# Altium project PCB_Project1.PrjPCB
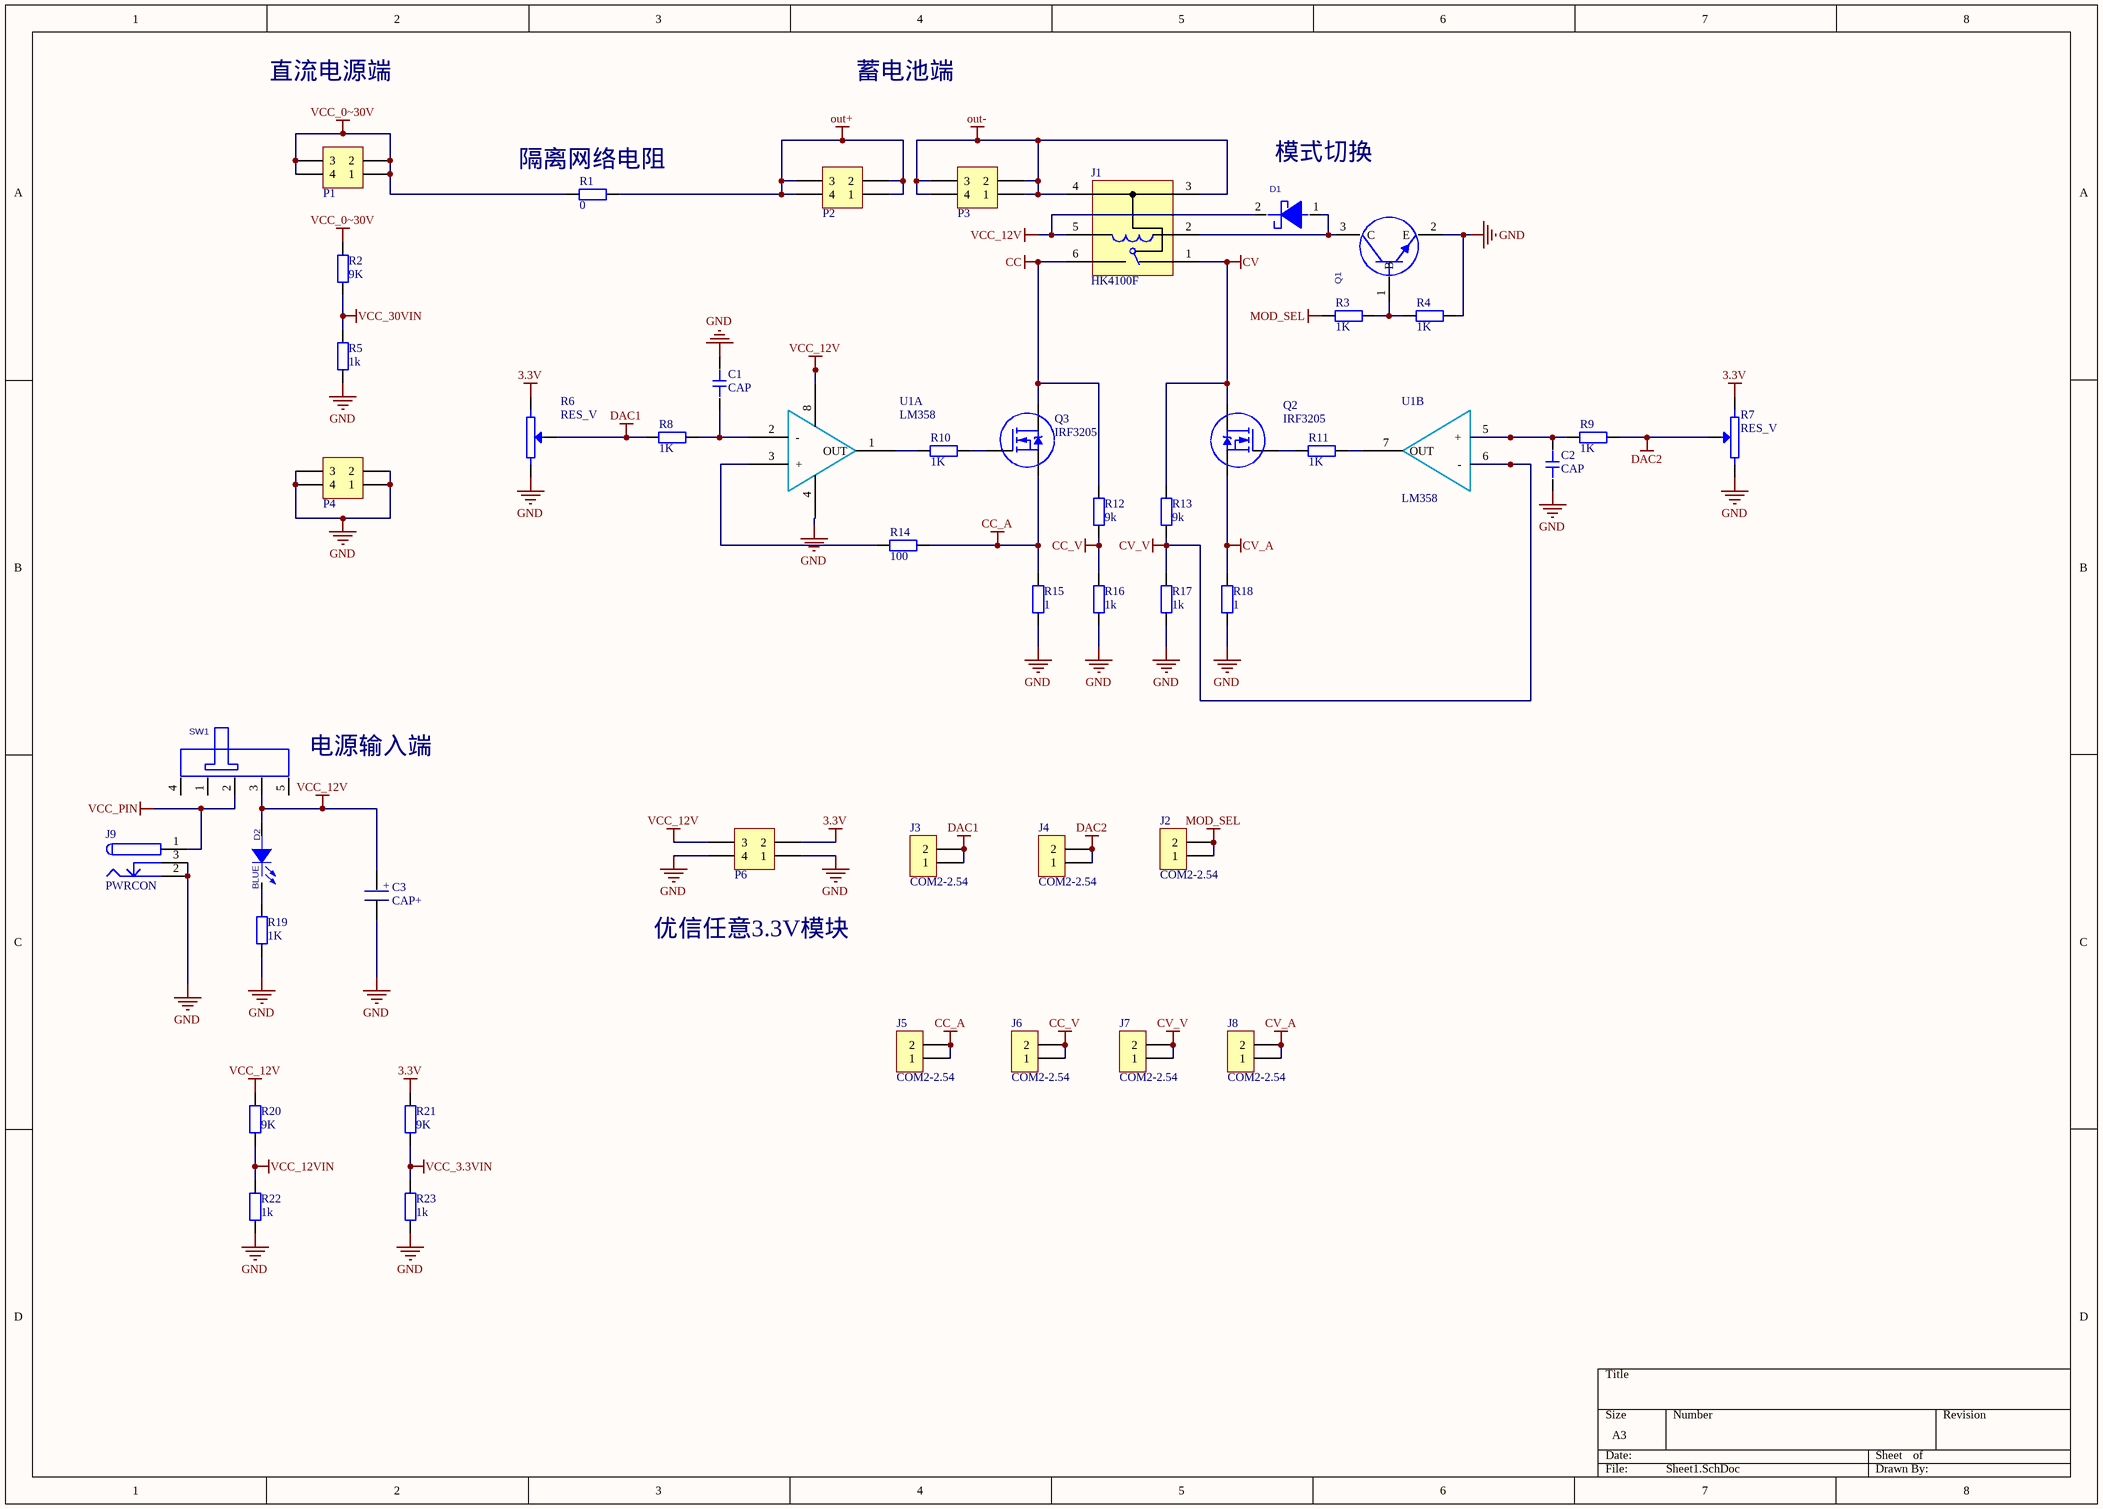
[diagram p0: Sheet1.SchDoc]
2 sheets, 97 parts. Net scope: global (net labels, ports and power ports of the same name join across sheets).
Board file: PCB1.PcbDoc
Sheets:
  Sheet1.SchDoc
  Sheet2.SchDoc

## Sheet Sheet1.SchDoc
size A3

### Parts
C1  CAP  [C_0805]
C2  CAP  [C_0805]
C3  CAP+  [CAP_2]
D1  SMAJ5.0CA  [DO-214-A]  (value not drawn)
D2  value BLUE  [LED_0603]  (hidden comment: LED)
J1  HK4100F  [RELAY-HK4100F]
J2  COM2-2.54  [HDR2X1-2.54]
J3  COM2-2.54  [HDR2X1-2.54]
J4  COM2-2.54  [HDR2X1-2.54]
J5  COM2-2.54  [HDR2X1-2.54]
J6  COM2-2.54  [HDR2X1-2.54]
J7  COM2-2.54  [HDR2X1-2.54]
J8  COM2-2.54  [HDR2X1-2.54]
J9  PWRCON  [DC-005]
P1  Header 2X2A  [HDR2X2-2.54]  (value not drawn)
P2  Header 2X2A  [HDR2X2-2.54]  (value not drawn)
P3  Header 2X2A  [HDR2X2-2.54]  (value not drawn)
P4  Header 2X2A  [HDR2X2-2.54]  (value not drawn)
P6  Header 2X2A  [HDR2X2-2.54]  (value not drawn)
Q1  8050  [SOT-23]  (value not drawn)
Q2  IRF3205  [TO-220L]
Q3  IRF3205  [TO-220L]
R1  value 0  [1210]  (hidden comment: Res1)
R2  value 9K  [0603-1]  (hidden comment: Res1)
R3  value 1K  [0603-1]  (hidden comment: Res1)
R4  value 1K  [0603-1]  (hidden comment: Res1)
R5  value 1k  [0603-1]  (hidden comment: Res1)
R6  RES_V  [RES_V4]
R7  RES_V  [RES_V4]
R8  value 1K  [0603-1]  (hidden comment: Res1)
R9  value 1K  [0603-1]  (hidden comment: Res1)
R10  value 1K  [0603-1]  (hidden comment: Res1)
R11  value 1K  [0603-1]  (hidden comment: Res1)
R12  value 9k  [0603-1]  (hidden comment: Res1)
R13  value 9k  [0603-1]  (hidden comment: Res1)
R14  value 100  [1210]  (hidden comment: Res1)
R15  value 1  [1210]  (hidden comment: Res1)
R16  value 1k  [0603-1]  (hidden comment: Res1)
R17  value 1k  [0603-1]  (hidden comment: Res1)
R18  value 1  [1210]  (hidden comment: Res1)
R19  value 1K  [0603-1]  (hidden comment: Res1)
R20  value 9K  [0603-1]  (hidden comment: Res1)
R21  value 9K  [0603-1]  (hidden comment: Res1)
R22  value 1k  [0603-1]  (hidden comment: Res1)
R23  value 1k  [0603-1]  (hidden comment: Res1)
SW1  SW-POWER  [SW13_6]  (value not drawn)
U1  LM358  [SOP8]  (parts A,B of 2)

### Nets
3.3V: P6.2 R6.4 R7.4 R21.2
CC: J1.6 Q3.2(D) R12.2
CC_A: J5.1 J5.2 Q3.3(S) R14.1 R15.2  [project net ADC0]
CC_V: J6.1 J6.2 R12.1 R16.2  [project net ADC1]
CV: J1.1 Q2.2(D) R13.2
CV_A: J8.1 J8.2 Q2.3(S) R18.2  [project net ADC3]
CV_V: J7.1 J7.2 R13.1 R17.2 U1.6(-)  [project net ADC2]
DAC1: J3.1 J3.2 R6.5(W) R8.1
DAC2: J4.1 J4.2 R7.5(W) R9.2
GND: C1.2 C2.2 C3.2 J9.2 J9.3 P4.1 P4.2 P4.3 P4.4 P6.1 P6.4 Q1.2(E) R4.1 R5.1 R6.6 R7.6 R15.1 R16.1 R17.1 R18.1 R19.1 R22.1 R23.1 U1.4(-VCC)
MOD_SEL: J2.1 J2.2 R3.1
out+: P2.1 P2.2 P2.3 P2.4 R1.1
out-: J1.3 J1.4 P3.1 P3.2 P3.3 P3.4
VCC_0~30V: P1.1 P1.2 P1.3 P1.4 R1.2 R2.2
VCC_3.3VIN: R21.1 R23.2
VCC_12V: C3.1 D1.2(-) D2.1(ANODE) J1.5 P6.3 R20.2 SW1.3 U1.8(VCC)
VCC_12VIN: R20.1 R22.2
VCC_30VIN: R2.1 R5.2
VCC_PIN: J9.1 SW1.2
NetC1_1: C1.1 R8.2 U1.2(-)
NetC2_1: C2.1 R9.1 U1.5(+)
NetD1_1: D1.1(+) J1.2 Q1.3(C)
NetD2_2: D2.2(CATHODE) R19.2
NetQ1_1: Q1.1(B) R3.2 R4.2
NetQ2_1: Q2.1(G) R11.1
NetQ3_1: Q3.1(G) R10.2
NetR10_1: R10.1 U1.1(OUT)
NetR11_2: R11.2 U1.7(OUT)
NetR14_2: R14.2 U1.3(+)

Not connected (* = marked no-connect by the designer): SW1 1 4 5

### Notes on the sheet
- 直流电源端
- 蓄电池端
- (near R1) 隔离网络电阻
- (near D1) 模式切换
- (near SW1) 电源输入端
- 优信任意3.3V模块
- (in symbol CAP+) +

### Library data of the parts
D1 = SMAJ5.0CA: SMAJ5.0CA-E3/61 400W 5V; PCB DECAL: DO-214; Manufacture 1 P/N: SMAJ5.0CA; Value: SMAJ5.0CA
J1 = HK4100F: 单刀双掷继电器
J9 = PWRCON: 直流电源端子; Published: 17-Dec-2003; DatasheetDocument: 09-May-2002; Publisher: Altium Limited; ComponentLink1Description: Manufacturer Link; ComponentLink1URL: http://domino.kycon.com/internet/Products.html
P1-P4 P6 = Header 2X2A: 接插件; LatestRevisionDate: 17-Jul-2002; LatestRevisionNote: Re-released for DXP Platform.; Publisher: Altium Limited
Q1 = 8050: NPN; Manufacturer #2: 8050; PCB DECAL: SOT-23
R1-R5 R8-R23 = Res1: 贴片电阻; Published: 8-Jun-2000; LatestRevisionDate: 17-Jul-2002; LatestRevisionNote: Re-released for DXP Platform.; PackageReference: AXIAL-0.4; Publisher: Altium Limited
SW1 = SW-POWER: SW-5; Manufacturer #1 PN: SW-5; PCB DECAL: SW13_6
D2 = LED: PCB DECAL: LED_0603

## Sheet Sheet2.SchDoc
size A2
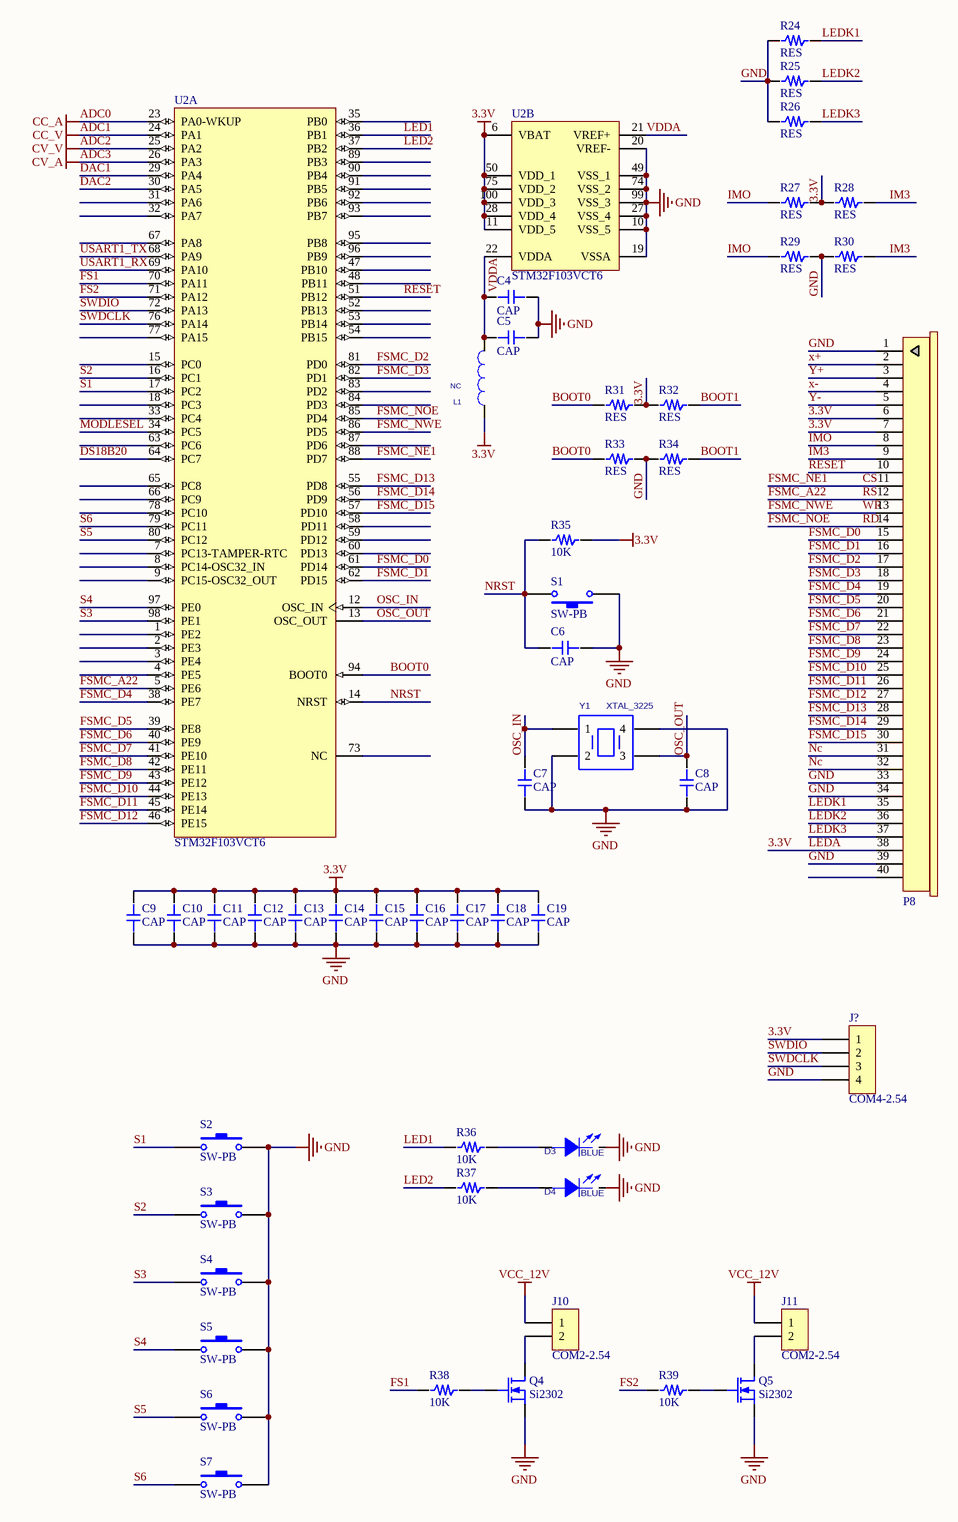
[diagram p1: Sheet2.SchDoc]

### Parts
C4  CAP  [C_0603]
C5  CAP  [C_0603]
C6  CAP  [C_0603-k]
C7  CAP  [C_0603-k]
C8  CAP  [C_0603-k]
C9  CAP  [C_0603]
C10  CAP  [C_0603]
C11  CAP  [C_0603]
C12  CAP  [C_0603]
C13  CAP  [C_0603]
C14  CAP  [C_0603]
C15  CAP  [C_0603]
C16  CAP  [C_0603]
C17  CAP  [C_0603]
C18  CAP  [C_0603]
C19  CAP  [C_0603]
D3  value BLUE  [LED_0603]  (hidden comment: LED)
D4  value BLUE  [LED_0603]  (hidden comment: LED)
J10  COM2-2.54  [COM2-2.54]
J11  COM2-2.54  [COM2-2.54]
J?  COM4-2.54  [COM4-2.54]
L1  value NC  [R_0805]  (hidden comment: IND)
P8  FPC  [FPC0.5-40P-A]  (value not drawn)
Q4  Si2302  [SOT-23]
Q5  Si2302  [SOT-23]
R24  RES  [R_0805]
R25  RES  [R_0805]
R26  RES  [R_0805]
R27  RES  [R_0603]
R28  RES  [R_0603]
R29  RES  [R_0603]
R30  RES  [R_0603]
R31  RES  [R_0603]
R32  RES  [R_0603]
R33  RES  [R_0603]
R34  RES  [R_0603]
R35  10K  [R_0603-k]
R36  10K  [R_0603-k]
R37  10K  [R_0603-k]
R38  10K  [R_0603-k]
R39  10K  [R_0603-k]
S1  SW-PB  [Switch-PB-C-K]
S2  SW-PB  [Switch-PB-C-K]
S3  SW-PB  [Switch-PB-C-K]
S4  SW-PB  [Switch-PB-C-K]
S5  SW-PB  [Switch-PB-C-K]
S6  SW-PB  [Switch-PB-C-K]
S7  SW-PB  [Switch-PB-C-K]
U2  STM32F103VCT6  [STM-LQFP100_N]  (parts A,B of 2)
Y1  XTAL_3225  [XTAL-3225-m]

### Nets
3.3V: C9.2 C10.2 C11.1 C12.1 C13.2 C14.1 C15.1 C16.2 C17.2 C18.2 C19.2 J?.1 L1.1 P8.6 P8.7 P8.38 R27.2 R28.1 R31.2 R32.1 R35.2 U2.6(VBAT) U2.11(VDD_5) U2.28(VDD_4) U2.50(VDD_1) U2.75(VDD_2) U2.100(VDD_3)  [also labelled LEDA]
ADC0: U2.23(PA0-WKUP)  [also labelled CC_A]
ADC1: U2.24(PA1)  [also labelled CC_V]
ADC2: U2.25(PA2)  [also labelled CV_V]
ADC3: U2.26(PA3)  [also labelled CV_A]
DAC1: U2.29(PA4)
DAC2: U2.30(PA5)
GND: C4.2 C5.1 C6.2 C7.1 C8.1 C9.1 C10.1 C11.2 C12.2 C13.1 C14.2 C15.2 C16.1 C17.1 C18.1 C19.1 D3.2(CATHODE) D4.2(CATHODE) J?.4 P8.1 P8.33 P8.34 P8.39 Q4.2(S) Q5.2(S) R24.1 R25.1 R26.1 R29.2 R30.1 R33.2 R34.1 S1.1 S2.2 S3.2 S4.2 S5.2 S6.2 S7.2 U2.10(VSS_5) U2.19(VSSA) U2.20(VREF-) U2.27(VSS_4) U2.49(VSS_1) U2.74(VSS_2) U2.99(VSS_3) Y1.2 Y1.4
VCC_12V: J10.1 J11.1
BOOT0: R31.1 R33.1 U2.94(BOOT0)
BOOT1: R32.2 R34.2
CS: P8.11 U2.88(PD7)  [also labelled FSMC_NE1]
DS18B20: U2.64(PC7)
FS1: R38.1 U2.70(PA11)
FS2: R39.1 U2.71(PA12)
FSMC_A22: P8.12 U2.5(PE6)  [also labelled RS]
FSMC_D0: P8.15 U2.61(PD14)
FSMC_D1: P8.16 U2.62(PD15)
FSMC_D2: P8.17 U2.81(PD0)
FSMC_D3: P8.18 U2.82(PD1)
FSMC_D4: P8.19 U2.38(PE7)
FSMC_D5: P8.20 U2.39(PE8)
FSMC_D6: P8.21 U2.40(PE9)
FSMC_D7: P8.22 U2.41(PE10)
FSMC_D8: P8.23 U2.42(PE11)
FSMC_D9: P8.24 U2.43(PE12)
FSMC_D10: P8.25 U2.44(PE13)
FSMC_D11: P8.26 U2.45(PE14)
FSMC_D12: P8.27 U2.46(PE15)
FSMC_D13: P8.28 U2.55(PD8)
FSMC_D14: P8.29 U2.56(PD9)
FSMC_D15: P8.30 U2.57(PD10)
FSMC_NOE: P8.14 U2.85(PD4)  [also labelled RD]
FSMC_NWE: P8.13 U2.86(PD5)  [also labelled WR]
IM3: P8.9 R28.2 R30.2
IMO: P8.8 R27.1 R29.1
LED1: R36.1 U2.36(PB1)
LED2: R37.1 U2.37(PB2)
LEDK1: P8.35 R24.2
LEDK2: P8.36 R25.2
LEDK3: P8.37 R26.2
MODLESEL: U2.34(PC5)
Nc: P8.31 P8.32
NRST: C6.1 R35.1 S1.2 U2.14(NRST)
OSC_IN: C7.2 U2.12(OSC_IN) Y1.1
OSC_OUT: C8.2 U2.13(OSC_OUT) Y1.3
RESET: P8.10 U2.51(PB12)
S1: S2.1 U2.17(PC2)
S2: S3.1 U2.16(PC1)
S3: S4.1 U2.98(PE1)
S4: S5.1 U2.97(PE0)
S5: S6.1 U2.80(PC12)
S6: S7.1 U2.79(PC11)
SWDCLK: J?.3 U2.76(PA14)
SWDIO: J?.2 U2.72(PA13)
USART1_RX: U2.69(PA10)
USART1_TX: U2.68(PA9)
VDDA: C4.1 C5.2 L1.2 U2.21(VREF+) U2.22(VDDA)
x+: P8.2
x-: P8.4
Y+: P8.3
Y-: P8.5
NetD3_1: D3.1(ANODE) R36.2
NetD4_1: D4.1(ANODE) R37.2
NetJ10_2: J10.2 Q4.3(D)
NetJ11_2: J11.2 Q5.3(D)
NetQ4_1: Q4.1(G) R38.2
NetQ5_1: Q5.1(G) R39.2

Not connected (* = marked no-connect by the designer): P8 40; U2 1(PE2) 2(PE3) 3(PE4) 4(PE5) 7(PC13-TAMPER-RTC) 8(PC14-OSC32_IN) 9(PC15-OSC32_OUT) 15(PC0) 18(PC3) 31(PA6) 32(PA7) 33(PC4) 35(PB0) 47(PB10) 48(PB11) 52(PB13) 53(PB14) 54(PB15) 58(PD11) 59(PD12) 60(PD13) 63(PC6) 65(PC8) 66(PC9) 67(PA8) 73(NC) 77(PA15) 78(PC10) 83(PD2) 84(PD3) 87(PD6) 89(PB3) 90(PB4) 91(PB5) 92(PB6) 93(PB7) 95(PB8) 96(PB9)

### Library data of the parts
L1 = IND: 1uH, 1.1R@245MHz, 245mA; Partname: 贴片电感; Mfr: TDK; Mfr_Part_Number: NLV25T-1R0J-PF; Part_Number: IN100085-01; PCB DECAL: R_0603; Spec: 1uH,NLV25T-1R0J-PF(TDK); Tolerance: 5%; Resistance: 1.1R; Source_Path: D:\CADENCELIB\CAPTURELIB\LC_PASSIVE.OLB; Current: 245mA; Availability: 0
P8 = FPC-40P: FPC排线连接器
Q4 Q5 = Si2302: Nmos
R35-R39 = RES
S1-S7 = SW-PB: Switch; Published: 24-Mar-1999; LatestRevisionDate: 17-Jul-2002; LatestRevisionNote: Re-released for DXP Platform.; PackageReference: SPST-2; Publisher: Altium Limited; PackageDescription: Switch; 2 Leads
U2 = STM32F103VCT6: ARM Cortex-M3 32-bit MCU, 256 KB Flash, 48 KB Internal RAM, 80 I/Os, 100-pin LQFP, -40 to 85 degC, Tray; A/D Converter: 3x12-bit (16 Channel); D/A Converter: 2x12-bit (2 Channel); FLASH Size (Prog) (kB): 256; I/Os (High Current): 80; Internal RAM Size (kB): 48; Operating Frequency(F) (Processor speed) (MHz): 72; Supply Voltage(Vcc) min (V): 2; DatasheetVersion: Rev. 8; PackageVersion: Rev. 1, 06/2013; PackageReference: LQFP100; PackageDescription: 100-Pin Low Profile Quad Flat Package, 14 x 14 mm Body, 0.5 mm Pitch; Supplier 1: Digi-Key; Supplier Part Number 1: 497-9034-ND; Supplier 2: Farnell; Supplier Part Number 2: 1624139; Supplier 3: Newark; Supplier Part Number 3: 57P1255; Supplier 4: Mouser; Supplier Part Number 4: 511-STM32F103VCT6; Core: ARM Cortex-M3; Packing: Tray; Mounting Technology: Surface Mount; PartNumber: STM32F103VCT6; ComponentLink1Description: Manufacturer URL; ComponentLink1URL: http://www.st.com/web/en/home.html; ComponentLink2Description: Datasheet; ComponentLink2URL: http://www.st.com/st-web-ui/static/active/en/resource/technical/document/datasheet/CD00191185.pdf; ComponentLink3Description: Package Specification; ComponentLink3URL: http://www.st.com/st-web-ui/static/active/en/resource/technical/document/data_brief/DM00071938.pdf
Y1 = XTAL_3225: 贴片晶振
D3 D4 = LED: PCB DECAL: LED_0603

## Nets that join several sheets
3.3V: Sheet1 (P6.2 R6.4 R7.4 R21.2), Sheet2 (27 pins)
ADC0: Sheet1 (5 pins), Sheet2 (U2.23)
ADC1: Sheet1 (J6.1 J6.2 R12.1 R16.2), Sheet2 (U2.24)
ADC2: Sheet1 (5 pins), Sheet2 (U2.25)
ADC3: Sheet1 (J8.1 J8.2 Q2.3 R18.2), Sheet2 (U2.26)
DAC1: Sheet1 (J3.1 J3.2 R6.5 R8.1), Sheet2 (U2.29)
DAC2: Sheet1 (J4.1 J4.2 R7.5 R9.2), Sheet2 (U2.30)
GND: Sheet1 (24 pins), Sheet2 (48 pins)
VCC_12V: Sheet1 (8 pins), Sheet2 (J10.1 J11.1)